# Altium schematic sheet 线圈主板V2.0.SchDoc
size A4
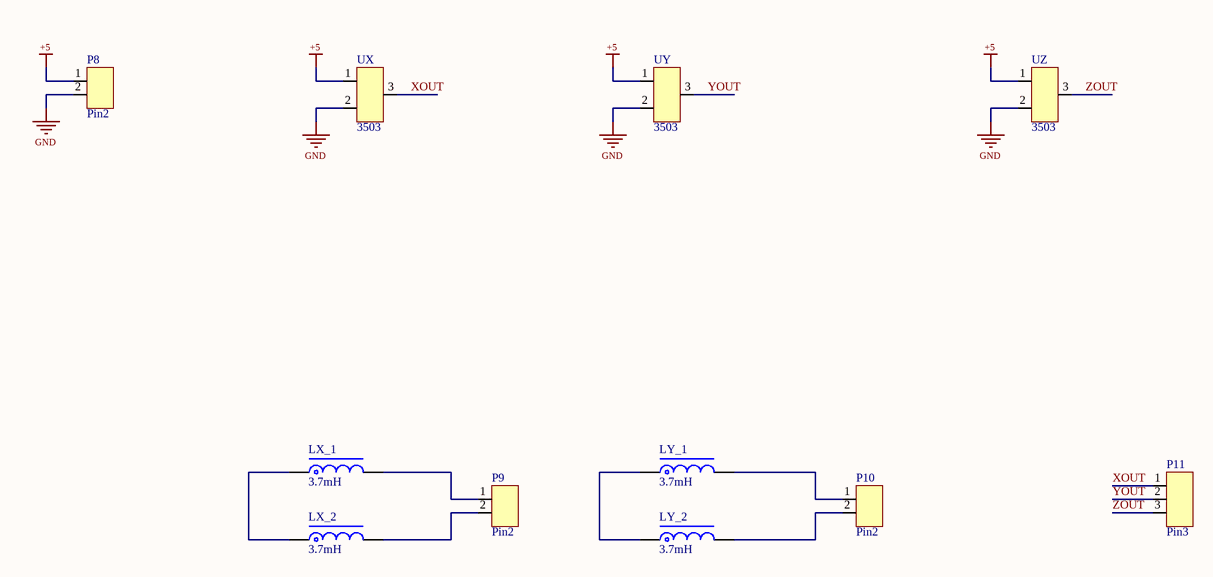
[diagram p0: 线圈主板V2.0.SchDoc]

## Parts
LX_1  3.7mH  [线圈]
LX_2  3.7mH  [线圈]
LY_1  3.7mH  [线圈]
LY_2  3.7mH  [线圈]
P8  Pin2  [HDR2.54-LI-2P]
P9  Pin2  [HDR2.54-LI-2P]
P10  Pin2  [HDR2.54-LI-2P]
P11  Pin3  [HDR2.54-LI-3P]
UX  3503  [49E]
UY  3503  [49E]
UZ  3503  [49E]

## Nets
+5: P8.1 UX.1(VCC) UY.1(VCC) UZ.1(VCC)
GND: P8.2 UX.2(GND) UY.2(GND) UZ.2(GND)
XOUT: P11.1 UX.3(OUT)
YOUT: P11.2 UY.3(OUT)
ZOUT: P11.3 UZ.3(OUT)
NetLX_1_1: LX_1.1 LX_2.1
NetLX_1_2: LX_1.2 P9.1
NetLX_2_2: LX_2.2 P9.2
NetLY_1_1: LY_1.1 LY_2.1
NetLY_1_2: LY_1.2 P10.1
NetLY_2_2: LY_2.2 P10.2

## Library data of the parts
LX_1 LX_2 LY_1 LY_2 = L-MR: 功率磁环电感; 版权归属: 源创客; BOM名称: 功率磁环电感; 学习资源: www.ooocke.com
P8 = Pin2: 两脚2.54mm排针
P9 P10 = L298N: 接L298N输出端口
P11 = Pin3: 三脚2.54mm排针
UX UY UZ = 49E: 49E线性霍尔元件